# Altium schematic sheet 5V_Load_Switches.SchDoc: Title
size A3; Project: Q24 VCU; ENG_APP_DATE: --/--/--; DSN_APP_DATE: --/--/--; CHK_APP_DATE: --/--/--; Date: *******; ApprovedBy: *******; CheckedBy: None; Author: *******; CompanyName: *******; DrawnBy: Jacob Chisholm; Engineer: *******; Organization: *******; Address1: *******; Address2: *******; Address3: *******; Address4: *******; DocumentNumber: 7; Revision: *******; SheetNumber: 7; SheetTotal: 14; Address_Website: https://jchisholm204.github.io; E-Mail: JacobChisholm1010@gmail.com; CurrentTime: *******; CurrentDate: *******; Time: *******; DocumentFullPathAndName: *******; DocumentName: *******; ModifiedDate: *******; ImagePath: *******; ProjectName: *******; Application_BuildNumber: *******
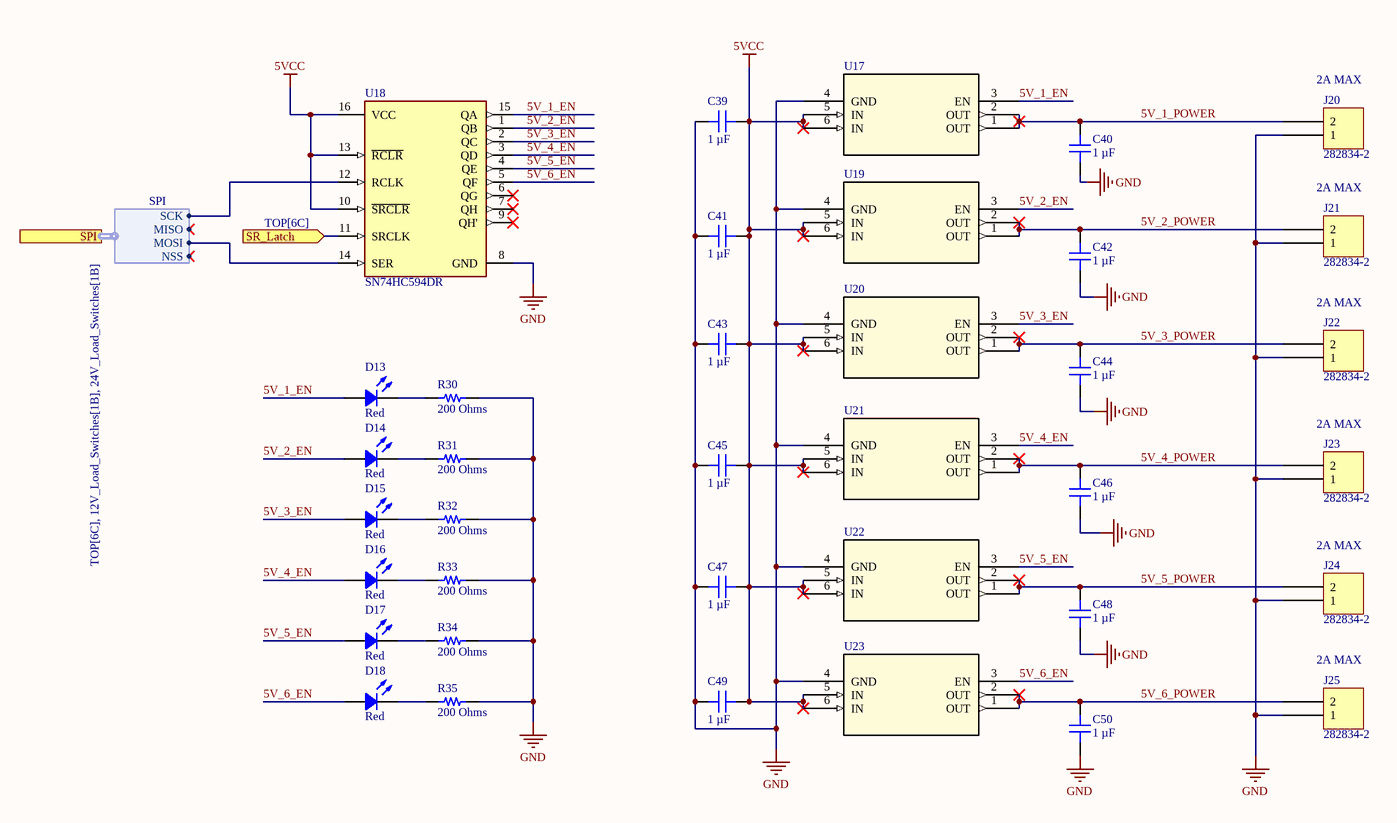
[diagram p0: 5V_Load_Switches.SchDoc]

## Parts
C39  1 µF  [CAP 0805_2012]
C40  1 µF  [CAP 0805_2012]
C41  1 µF  [CAP 0805_2012]
C42  1 µF  [CAP 0805_2012]
C43  1 µF  [CAP 0805_2012]
C44  1 µF  [CAP 0805_2012]
C45  1 µF  [CAP 0805_2012]
C46  1 µF  [CAP 0805_2012]
C47  1 µF  [CAP 0805_2012]
C48  1 µF  [CAP 0805_2012]
C49  1 µF  [CAP 0805_2012]
C50  1 µF  [CAP 0805_2012]
D13  Red  [LED 0603_1608 RED]
D14  Red  [LED 0603_1608 RED]
D15  Red  [LED 0603_1608 RED]
D16  Red  [LED 0603_1608 RED]
D17  Red  [LED 0603_1608 RED]
D18  Red  [LED 0603_1608 RED]
J20  282834-2  [TE 282834-2]
J21  282834-2  [TE 282834-2]
J22  282834-2  [TE 282834-2]
J23  282834-2  [TE 282834-2]
J24  282834-2  [TE 282834-2]
J25  282834-2  [TE 282834-2]
R30  200 Ohms  [RES 0603_1608]
R31  200 Ohms  [RES 0603_1608]
R32  200 Ohms  [RES 0603_1608]
R33  200 Ohms  [RES 0603_1608]
R34  200 Ohms  [RES 0603_1608]
R35  200 Ohms  [RES 0603_1608]
U17  (no value)  [SIP32510DT-T1-GE3_VIS]
U18  SN74HC594DR  [FP-D0016A-IPC_A]
U19  (no value)  [SIP32510DT-T1-GE3_VIS]
U20  (no value)  [SIP32510DT-T1-GE3_VIS]
U21  (no value)  [SIP32510DT-T1-GE3_VIS]
U22  (no value)  [SIP32510DT-T1-GE3_VIS]
U23  (no value)  [SIP32510DT-T1-GE3_VIS]

## Ports
SPI (harness SPI, see TOP[6C], 12V_Load_Switches[1B], 24V_Load_Switches[1B]), SR_Latch (in, see TOP[6C])

## Harnesses
SPI: NSS, SCK, MISO, MOSI

## Nets
5VCC: C39.2 C41.2 C43.2 C45.2 C47.2 C49.2 U17.5(IN) U17.6(IN) U18.10(~{SRCLR}) U18.13(~{RCLR}) U18.16(VCC) U19.5(IN) U19.6(IN) U20.5(IN) U20.6(IN) U21.5(IN) U21.6(IN) U22.5(IN) U22.6(IN) U23.5(IN) U23.6(IN)
GND: C39.1 C40.1 C41.1 C42.1 C43.1 C44.1 C45.1 C46.1 C47.1 C48.1 C49.1 C50.1 J20.1 J21.1 J22.1 J23.1 J24.1 J25.1 R30.2 R31.2 R32.2 R33.2 R34.2 R35.2 U17.4(GND) U18.8(GND) U19.4(GND) U20.4(GND) U21.4(GND) U22.4(GND) U23.4(GND)
5V_1_EN: D13.1 U17.3(EN) U18.15(QA)
5V_1_POWER: C40.2 J20.2 U17.1(OUT) U17.2(OUT)
5V_2_EN: D14.1 U18.1(QB) U19.3(EN)
5V_2_POWER: C42.2 J21.2 U19.1(OUT) U19.2(OUT)
5V_3_EN: D15.1 U18.2(QC) U20.3(EN)
5V_3_POWER: C44.2 J22.2 U20.1(OUT) U20.2(OUT)
5V_4_EN: D16.1 U18.3(QD) U21.3(EN)
5V_4_POWER: C46.2 J23.2 U21.1(OUT) U21.2(OUT)
5V_5_EN: D17.1 U18.4(QE) U22.3(EN)
5V_5_POWER: C48.2 J24.2 U22.1(OUT) U22.2(OUT)
5V_6_EN: D18.1 U18.5(QF) U23.3(EN)
5V_6_POWER: C50.2 J25.2 U23.1(OUT) U23.2(OUT)
SR_Latch: U18.11(SRCLK) ; port SR_Latch
NetD13_2: D13.2 R30.1
NetD14_2: D14.2 R31.1
NetD15_2: D15.2 R32.1
NetD16_2: D16.2 R33.1
NetD17_2: D17.2 R34.1
NetD18_2: D18.2 R35.1
NetU18_12: U18.12(RCLK) ; port SPI.SCK
NetU18_14: U18.14(SER) ; port SPI.MOSI

Not connected (* = marked no-connect by the designer): U18 6(QG)* 7(QH)* 9(QH')*

## Notes on the sheet
- (near J20) 2A MAX
- 2A MAX
- (near J23) 2A MAX
- (near J24) 2A MAX
- Title:
- Drawn By:
- Page Contents:
- Checked By:
- Size:
- Date:
- File:
- License:
- Email:
- A3
- Number:
- Time:
- Revision:
- Sheet
- Website:
- of

## Library data of the parts
C39-C48 C50 = 0805B105K500CT: CAP CER 1UF 50V X7R 0805; manufacturer: Walsin Technology Corporation; Tolerance: ±10%; Part Number: 0805B105K500CT; Value: 1 µF; Applications: General Purpose; Capacitance: 1 µF; componentlink1description: Datasheet; componentlink1url: https://www.passivecomponent.com/wp-content/uploads/datasheet/WTC_MLCC_General_Purpose.pdf; componentlink2description: DigiKey Link; componentlink2url: https://www.digikey.com/en/products/detail/walsin-technology-corporation/0805B105K500CT/14836864; Device Package: 0805 (2012 Metric); lastupdated: 12/20/2023 8:12:21 PM; Lifecycle Status: Active; Minimum Order: 1; Mounting Type: Surface Mount, MLCC; Operating Temperature: -55°C ~ 125°C; Package / Case: 0805 (2012 Metric); packaging: TapeAndReel; partid: 41252; Part Status: Active; price: 0.05; series: -; Size / Dimension: 0.079" L x 0.049" W (2.00mm x 1.25mm); Supplier 1: DigiKey; Supplier Part Number 1: 1292-0805B105K500CT-ND; Temperature Coefficient: X7R; Thickness (Max): 0.057" (1.45mm); Voltage - Rated: 50V
C49 = 08051Z105KAT2A: 0805 X7S 1UF10% 100V; manufacturer: KYOCERA AVX; Tolerance: ±10%; Part Number: 08051Z105KAT2A; Value: 1 µF; Applications: General Purpose; Capacitance: 1 µF; componentlink1description: Datasheet; componentlink1url: https://datasheets.kyocera-avx.com/X7S.pdf; componentlink2description: DigiKey Link; componentlink2url: https://www.digikey.com/en/products/detail/kyocera-avx/08051Z105KAT2A/17866368; Device Package: 0805 (2012 Metric); lastupdated: 2/1/2024 8:13:20 PM; Lifecycle Status: Active; Minimum Order: 1; Mounting Type: Surface Mount, MLCC; Operating Temperature: -55°C ~ 125°C; Package / Case: 0805 (2012 Metric); packaging: TapeAndReel; partid: 54857; Part Status: Active; price: 0.08; series: -; Size / Dimension: 0.079" L x 0.049" W (2.01mm x 1.25mm); Supplier 1: DigiKey; Supplier Part Number 1: 478-08051Z105KAT2ACT-ND; Temperature Coefficient: X7S; Voltage - Rated: 100V
D13-D18 = 19-213SDRC/S259/TR8: LED RED CLEAR 2SMD; Manufacturer: Everlight Electronics Co Ltd; Configuration: Standard; Current - Test: 10mA; Lens Color: Colorless; Lens Size: 1.20mm x 0.80mm; Lens Style: Rectangle with Flat Top; Viewing Angle: 120°; Voltage - Forward (Vf) (Typ): 2V; Wavelength - Peak: 650nm; Part Number: 19-213SDRC/S259/TR8; Color: Red; ComponentLink1Description: Datasheet; ComponentLink1URL: //media.digikey.com/pdf/Data%20Sheets/Everlight%20PDFs/19-213SDRC-S259-TR8.pdf; ComponentLink2Description: DigiKey Link; ComponentLink2URL: http://digikey.com/product-detail/en/everlight-electronics-co-ltd/19-213SDRC-S259-TR8/1080-1580-1-ND/8535303; Device Package: 0603 (1608 Metric); Height (Max): 0.70mm; LastUpdated: 2/2/2024 9:29:56 PM; Lens Transparency: Clear; Lifecycle Status: Active; Minimum Order: 1; Mounting Type: Surface Mount; Package / Case: 0603 (1608 Metric); Packaging: TapeAndReel; PartId: 372; Part Status: Active; Price: 0.06; Series: -; Size / Dimension: 1.60mm L x 0.80mm W; Supplier 1: DigiKey; Supplier Part Number 1: 1080-1580-1-ND; Supplier Device Package: 2-SMD; Value: Red
J20-J25 = 282834-2: TERM BLK 2P SIDE ENT 2.54MM PCB; Manufacturer: TE Connectivity AMP Connectors; Current: 10A; Mating Orientation: Horizontal with Board; Number of Levels: 1; Pitch: 0.100" (2.54mm); Positions Per Level: 2; Voltage: 150V; Wire Gauge: 16-30 AWG; Wire Termination: Screw - Rising Cage Clamp; Part Number: 282834-2; Color: Green; ComponentLink1Description: Datasheet; ComponentLink1URL: https://www.te.com/commerce/DocumentDelivery/DDEController?Action=srchrtrv&DocNm=282834&DocType=Customer+Drawing&DocLang=English; ComponentLink2Description: DigiKey Link; ComponentLink2URL: http://digikey.com/product-detail/en/te-connectivity-amp-connectors/282834-2/A98333-ND/1150135; LastUpdated: 1/15/2020 4:15:38 AM; Lifecycle Status: Active; Minimum Order: 1; Mounting Type: Through Hole; Packaging: Bulk; Part Status: Active; Price: 0.88; Series: Buchanan; Supplier 1: DigiKey; Supplier Part Number 1: A98333-ND
R30-R35 = RS73F1JTTD2000B: RES 200 OHM 0.1% 1/5W 0603; Manufacturer: KOA Speer Electronics, Inc.; Power (Watts): 0.2W, 1/5W; Temperature Coefficient: ±25ppm/°C; Part Number: RS73F1JTTD2000B; Value: 200 Ohms; ComponentLink1Description: Datasheet; ComponentLink1URL: http://www.koaspeer.com/pdfs/RS73.pdf; ComponentLink2Description: DigiKey Link; ComponentLink2URL: https://www.digikey.com/en/products/detail/koa-speer-electronics-inc/RS73F1JTTD2000B/11594419; Composition: Thick Film; Device Package: 0603 (1608 Metric); Features: Automotive AEC-Q200, Moisture Resistant; Height - Seated (Max): 0.022" (0.55mm); LastUpdated: 2/2/2024 8:38:37 PM; Lifecycle Status: Active; Minimum Order: 1; Number of Terminations: 2; Operating Temperature: -55°C ~ 155°C; Package / Case: 0603 (1608 Metric); Packaging: TapeAndReel; PartId: 56369; Part Status: Active; Price: 0.07; Ratings: AEC-Q200; Resistance: 200 Ohms; Series: RS73; Size / Dimension: 0.063" L x 0.031" W (1.60mm x 0.80mm); Supplier 1: DigiKey; Supplier Part Number 1: 2019-RS73F1JTTD2000BCT-ND; Supplier Device Package: 0603; Tolerance: ±0.1%
U17 U19-U23 = SIP32510DT-T1-GE3: No Description Available; Mfr_Name: Vishay; Copyright: Copyright (C) 2023 Ultra Librarian. All rights reserved.; Manufacturer_Part_Number: SIP32510DT-T1-GE3; RefDes: RefDes; Type: DEV
U18 = CMP-0780-00061-4: IC SHIFT REGISTER 8BIT 16-SOIC; Number of Bits per Element: 8; Min Supply Voltage: 2V; Frequency: 40MHz; Max Supply Voltage: 6V; Operating Supply Voltage: 5V; Number of Output Lines: 10; Propagation Delay: 25ns; Number of Elements: 1; Number of Circuits: 4; Direction: Unidirectional; Turn-On Delay Time: 185ns; RoHS Compliant: Yes; Width: 3.91mm; Length: 9.9mm; Min Operating Temperature: -40°C; Max Operating Temperature: 125°C; Package Quantity: 2500; Series: 74HC; Height: 1.58mm; Number of Bits: 8; Mount: Surface Mount; Logic Function: Shift Register; Radiation Hardening: No; Number of Pins: 16; Technology: CMOS; Packaging: Tape and Reel; Lead Free: Lead Free; Weight: 0.004998oz; REACH SVHC: No SVHC; Case/Package: SOIC